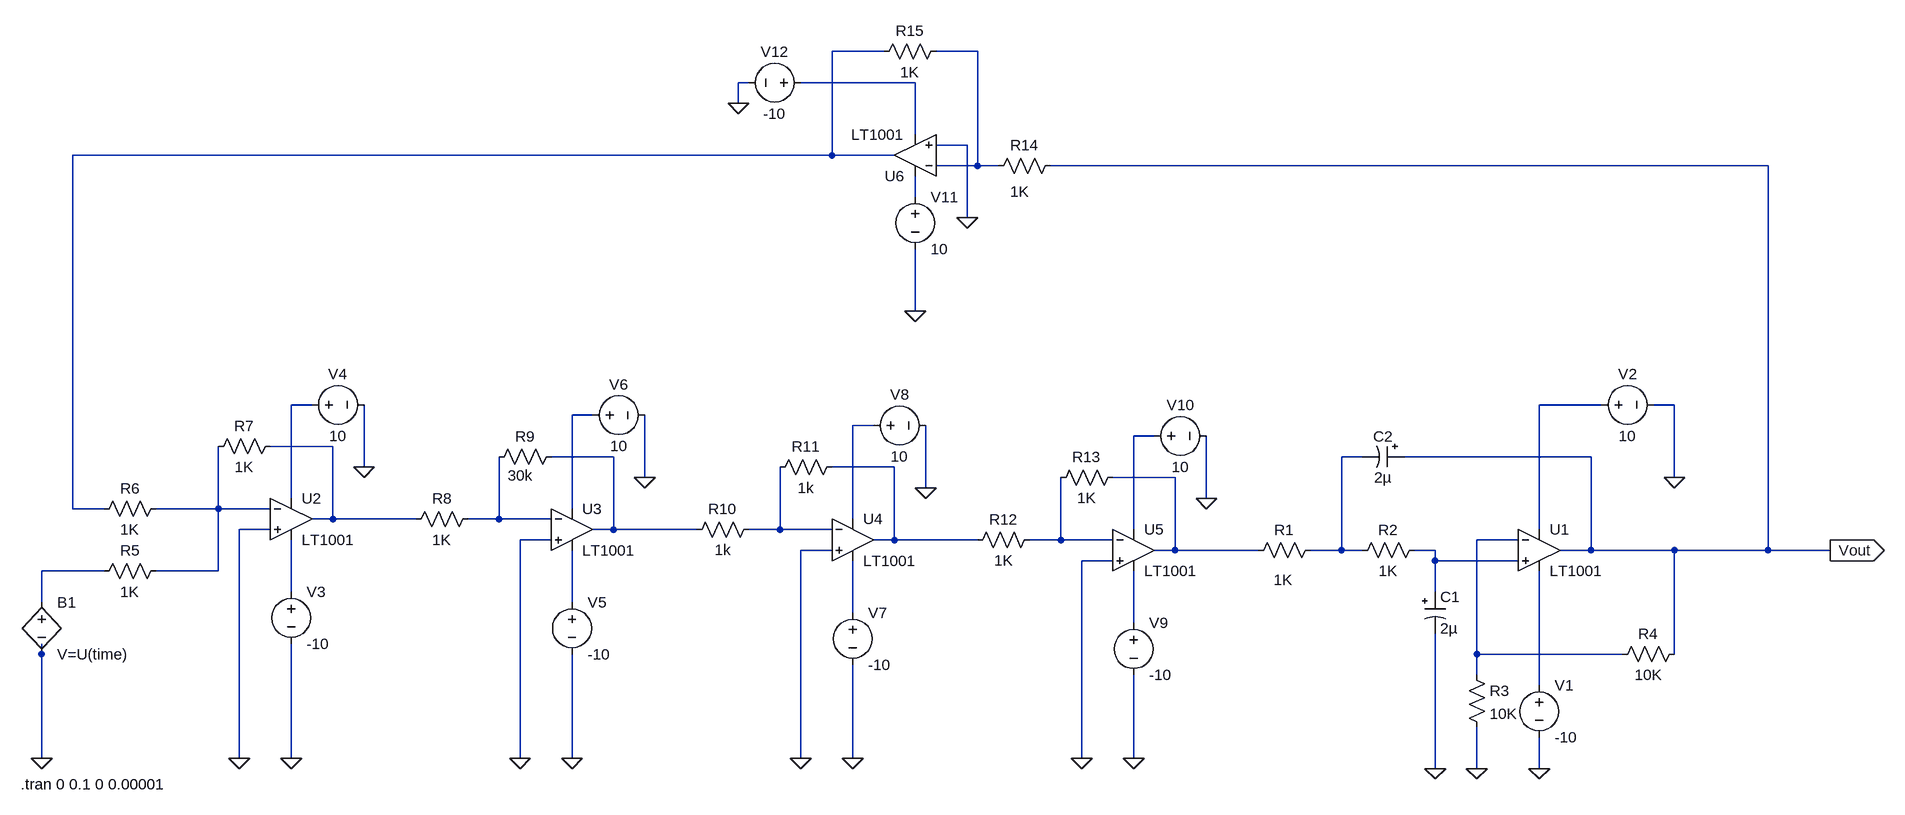
[diagram p0: schematic EC5030_Design Project_2021E171_Design2_Task1.asc]
EC5030_Design Project_2021E171_Design2_Task1.asc, the LTspice schematic file:
Version 4
SHEET 1 2832 680
WIRE 1264 -832 1184 -832
WIRE 1408 -832 1344 -832
WIRE 1056 -784 1040 -784
WIRE 1312 -784 1136 -784
WIRE 1040 -752 1040 -784
WIRE 1312 -704 1312 -784
WIRE 1392 -688 1344 -688
WIRE 1184 -672 1184 -832
WIRE 1184 -672 16 -672
WIRE 1280 -672 1184 -672
WIRE 1408 -656 1408 -832
WIRE 1408 -656 1344 -656
WIRE 1440 -656 1408 -656
WIRE 2624 -656 1520 -656
WIRE 1312 -608 1312 -640
WIRE 1392 -576 1392 -688
WIRE 1312 -432 1312 -528
WIRE 384 -288 352 -288
WIRE 2368 -288 2272 -288
WIRE 2480 -288 2448 -288
WIRE 816 -272 784 -272
WIRE 1248 -256 1216 -256
WIRE 1680 -240 1648 -240
WIRE 416 -224 320 -224
WIRE 848 -208 752 -208
WIRE 2000 -208 1968 -208
WIRE 2352 -208 2064 -208
WIRE 464 -192 464 -288
WIRE 1280 -192 1184 -192
WIRE 896 -176 896 -272
WIRE 1712 -176 1616 -176
WIRE 2480 -176 2480 -288
WIRE 1328 -160 1328 -256
WIRE 352 -144 352 -288
WIRE 1760 -144 1760 -240
WIRE 16 -128 16 -672
WIRE 64 -128 16 -128
WIRE 240 -128 240 -224
WIRE 240 -128 144 -128
WIRE 320 -128 240 -128
WIRE 784 -128 784 -272
WIRE 416 -112 416 -224
WIRE 416 -112 384 -112
WIRE 544 -112 416 -112
WIRE 672 -112 672 -208
WIRE 672 -112 624 -112
WIRE 752 -112 672 -112
WIRE 1216 -112 1216 -256
WIRE 320 -96 272 -96
WIRE 848 -96 848 -208
WIRE 848 -96 816 -96
WIRE 976 -96 848 -96
WIRE 1104 -96 1104 -192
WIRE 1104 -96 1056 -96
WIRE 1184 -96 1104 -96
WIRE 1648 -96 1648 -240
WIRE 2272 -96 2272 -288
WIRE 752 -80 704 -80
WIRE 1280 -80 1280 -192
WIRE 1280 -80 1248 -80
WIRE 1408 -80 1280 -80
WIRE 1536 -80 1536 -176
WIRE 1536 -80 1488 -80
WIRE 1616 -80 1536 -80
WIRE 2240 -80 2176 -80
WIRE 1184 -64 1136 -64
WIRE 1712 -64 1712 -176
WIRE 1712 -64 1680 -64
WIRE 1840 -64 1712 -64
WIRE 1968 -64 1968 -208
WIRE 1968 -64 1920 -64
WIRE 2000 -64 1968 -64
WIRE 2112 -64 2080 -64
WIRE 2352 -64 2352 -208
WIRE 2352 -64 2304 -64
WIRE 2480 -64 2352 -64
WIRE 2624 -64 2624 -656
WIRE 2624 -64 2480 -64
WIRE 2720 -64 2624 -64
WIRE 1616 -48 1568 -48
WIRE 2112 -48 2112 -64
WIRE 2240 -48 2112 -48
WIRE 64 -32 -32 -32
WIRE 240 -32 240 -128
WIRE 240 -32 144 -32
WIRE 352 0 352 -80
WIRE 2112 0 2112 -48
WIRE -32 16 -32 -32
WIRE 784 16 784 -64
WIRE 1216 32 1216 -48
WIRE 1648 48 1648 -32
WIRE -32 96 -32 80
WIRE 2176 96 2176 -80
WIRE 2400 96 2176 96
WIRE 2480 96 2480 -64
WIRE 2176 128 2176 96
WIRE 2272 144 2272 -32
WIRE -32 256 -32 96
WIRE 272 256 272 -96
WIRE 352 256 352 80
WIRE 704 256 704 -80
WIRE 784 256 784 96
WIRE 1136 256 1136 -64
WIRE 1216 256 1216 112
WIRE 1568 256 1568 -48
WIRE 1648 256 1648 128
WIRE 2112 272 2112 64
WIRE 2176 272 2176 208
WIRE 2272 272 2272 224
FLAG 2176 272 0
FLAG 2112 272 0
FLAG 2272 272 0
FLAG 2480 -176 0
FLAG 1760 -144 0
FLAG 1648 256 0
FLAG 1568 256 0
FLAG 1328 -160 0
FLAG 1216 256 0
FLAG 1136 256 0
FLAG 896 -176 0
FLAG 784 256 0
FLAG 704 256 0
FLAG 464 -192 0
FLAG 352 256 0
FLAG 272 256 0
FLAG -32 256 0
FLAG 1312 -432 0
FLAG 1040 -752 0
FLAG 1392 -576 0
FLAG 2720 -64 Vout
IOPIN 2720 -64 Out
SYMBOL voltage 2272 128 R0
WINDOW 123 0 0 Left 0
WINDOW 39 0 0 Left 0
SYMATTR InstName V1
SYMATTR Value -10
SYMBOL voltage 368 -288 R270
WINDOW 0 32 56 VTop 2
WINDOW 3 -32 56 VBottom 2
WINDOW 123 0 0 Left 0
WINDOW 39 0 0 Left 0
SYMATTR InstName V4
SYMATTR Value 10
SYMBOL res 336 -240 R90
WINDOW 0 0 56 VBottom 2
WINDOW 3 32 56 VTop 2
SYMATTR InstName R7
SYMATTR Value 1K
SYMBOL polcap 2096 0 R0
SYMATTR InstName C1
SYMATTR Value 2µ
SYMBOL polcap 2064 -224 R90
WINDOW 0 0 32 VBottom 2
WINDOW 3 32 32 VTop 2
SYMATTR InstName C2
SYMATTR Value 2µ
SYMBOL OpAmps\\LT1001 2272 -128 R0
SYMATTR InstName U1
SYMBOL res 2160 112 R0
SYMATTR InstName R3
SYMATTR Value 10K
SYMBOL res 2496 80 R90
WINDOW 0 0 56 VBottom 2
WINDOW 3 32 56 VTop 2
SYMATTR InstName R4
SYMATTR Value 10K
SYMBOL OpAmps\\LT1001 1648 -128 R0
SYMATTR InstName U5
SYMBOL voltage 352 -16 R0
WINDOW 123 0 0 Left 0
WINDOW 39 0 0 Left 0
SYMATTR InstName V3
SYMATTR Value -10
SYMBOL voltage 2352 -288 R270
WINDOW 0 32 56 VTop 2
WINDOW 3 -32 56 VBottom 2
WINDOW 123 0 0 Left 0
WINDOW 39 0 0 Left 0
SYMATTR InstName V2
SYMATTR Value 10
SYMBOL res 160 -144 R90
WINDOW 0 0 56 VBottom 2
WINDOW 3 32 56 VTop 2
SYMATTR InstName R6
SYMATTR Value 1K
SYMBOL res 1200 -208 R90
WINDOW 0 0 56 VBottom 2
WINDOW 3 32 56 VTop 2
SYMATTR InstName R11
SYMATTR Value 1k
SYMBOL OpAmps\\LT1001 1216 -144 R0
SYMATTR InstName U4
SYMBOL voltage 784 0 R0
WINDOW 123 0 0 Left 0
WINDOW 39 0 0 Left 0
SYMATTR InstName V5
SYMATTR Value -10
SYMBOL voltage 800 -272 R270
WINDOW 0 32 56 VTop 2
WINDOW 3 -32 56 VBottom 2
WINDOW 123 0 0 Left 0
WINDOW 39 0 0 Left 0
SYMATTR InstName V6
SYMATTR Value 10
SYMBOL res 640 -128 R90
WINDOW 0 0 56 VBottom 2
WINDOW 3 32 56 VTop 2
SYMATTR InstName R8
SYMATTR Value 1K
SYMBOL res 768 -224 R90
WINDOW 0 0 56 VBottom 2
WINDOW 3 29 63 VTop 2
SYMATTR InstName R9
SYMATTR Value 30k
SYMBOL OpAmps\\LT1001 784 -160 R0
SYMATTR InstName U3
SYMBOL voltage 1216 16 R0
WINDOW 123 0 0 Left 0
WINDOW 39 0 0 Left 0
SYMATTR InstName V7
SYMATTR Value -10
SYMBOL voltage 1232 -256 R270
WINDOW 0 32 56 VTop 2
WINDOW 3 -32 56 VBottom 2
WINDOW 123 0 0 Left 0
WINDOW 39 0 0 Left 0
SYMATTR InstName V8
SYMATTR Value 10
SYMBOL res 1072 -112 R90
WINDOW 0 0 56 VBottom 2
WINDOW 3 32 56 VTop 2
SYMATTR InstName R10
SYMATTR Value 1k
SYMBOL res 1632 -192 R90
WINDOW 0 0 56 VBottom 2
WINDOW 3 32 56 VTop 2
SYMATTR InstName R13
SYMATTR Value 1K
SYMBOL OpAmps\\LT1001 352 -176 R0
SYMATTR InstName U2
SYMBOL voltage 1648 32 R0
WINDOW 123 0 0 Left 0
WINDOW 39 0 0 Left 0
SYMATTR InstName V9
SYMATTR Value -10
SYMBOL voltage 1664 -240 R270
WINDOW 0 32 56 VTop 2
WINDOW 3 -32 56 VBottom 2
WINDOW 123 0 0 Left 0
WINDOW 39 0 0 Left 0
SYMATTR InstName V10
SYMATTR Value 10
SYMBOL res 1504 -96 R90
WINDOW 0 0 56 VBottom 2
WINDOW 3 32 56 VTop 2
SYMATTR InstName R12
SYMATTR Value 1K
SYMBOL res 1936 -80 R90
WINDOW 0 0 56 VBottom 2
WINDOW 3 46 58 VTop 2
SYMATTR InstName R1
SYMATTR Value 1K
SYMBOL res 160 -48 R90
WINDOW 0 0 56 VBottom 2
WINDOW 3 32 56 VTop 2
SYMATTR InstName R5
SYMATTR Value 1K
SYMBOL res 1360 -848 R90
WINDOW 0 0 56 VBottom 2
WINDOW 3 32 56 VTop 2
SYMATTR InstName R15
SYMATTR Value 1K
SYMBOL OpAmps\\LT1001 1312 -608 R180
SYMATTR InstName U6
SYMBOL res 1536 -672 R90
WINDOW 0 0 56 VBottom 2
WINDOW 3 40 63 VTop 2
SYMATTR InstName R14
SYMATTR Value 1K
SYMBOL res 2096 -80 R90
WINDOW 0 0 56 VBottom 2
WINDOW 3 32 56 VTop 2
SYMATTR InstName R2
SYMATTR Value 1K
SYMBOL voltage 1312 -624 R0
WINDOW 123 0 0 Left 0
WINDOW 39 0 0 Left 0
SYMATTR InstName V11
SYMATTR Value 10
SYMBOL voltage 1152 -784 R90
WINDOW 0 -32 56 VBottom 2
WINDOW 3 32 56 VTop 2
WINDOW 123 0 0 Left 0
WINDOW 39 0 0 Left 0
SYMATTR InstName V12
SYMATTR Value -10
SYMBOL bv -32 0 R0
SYMATTR InstName B1
SYMATTR Value V=U(time)
TEXT -64 296 Left 2 !.tran 0 0.1 0 0.00001

The netlist it stands for:
* EC5030_Design Project_2021E171_Design2_Task1.asc
V1 N026 0 -10
V4 N005 0 10
R7 N010 N015 1K
C1 N020 0 2µ
C2 Vout N012 2µ
XU1 N020 N019 N006 N026 Vout LT1001  ; pins In+ In- V+ V- OUT
R3 N019 0 10K
R4 Vout N019 10K
XU5 0 N018 N009 N025 N014 LT1001  ; pins In+ In- V+ V- OUT
V3 N022 0 -10
V2 N006 0 10
R6 N015 N001 1K
R11 N013 N017 1k
XU4 0 N017 N008 N024 N013 LT1001  ; pins In+ In- V+ V- OUT
V5 N023 0 -10
V6 N007 0 10
R8 N016 N010 1K
R9 N011 N016 30k
XU3 0 N016 N007 N023 N011 LT1001  ; pins In+ In- V+ V- OUT
V7 N024 0 -10
V8 N008 0 10
R10 N017 N011 1k
R13 N014 N018 1K
XU2 0 N015 N005 N022 N010 LT1001  ; pins In+ In- V+ V- OUT
V9 N025 0 -10
V10 N009 0 10
R12 N018 N013 1K
R1 N012 N014 1K
R5 N015 N021 1K
R15 N002 N001 1K
XU6 0 N002 N004 N003 N001 LT1001  ; pins In+ In- V+ V- OUT
R14 Vout N002 1K
R2 N020 N012 1K
V11 N004 0 10
V12 N003 0 -10
B1 N021 0 V=U(time)
.tran 0 0.1 0 0.00001
.lib LTC.lib
.backanno
.end